# EasyEDA Pro project QRS959041_JiaLichuang.epro

# Schematic Schematic1
Create Date: 2025-01-12; Page Name: P1; Project Name: 1.12寒假; Schematic Name: Schematic1; Update Date: 2025-02-10; Company: 嘉立创EDA; Page Size: A4; Version: V1.0
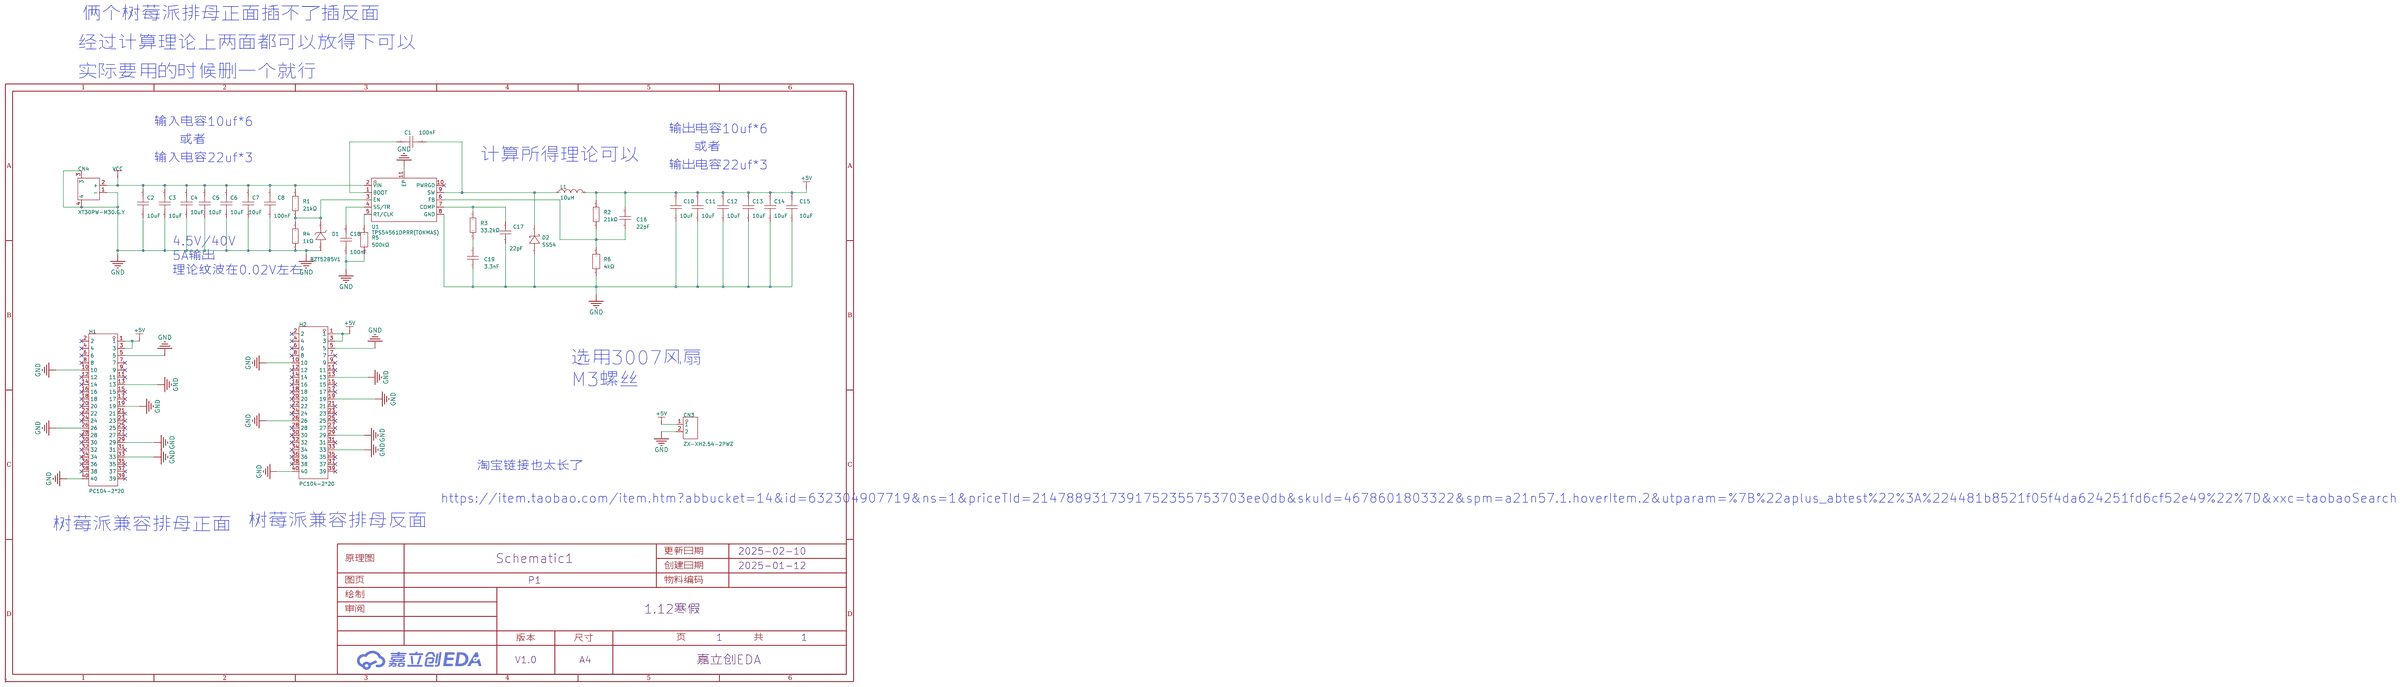
[diagram p0: schematic sheet]

## Parts
C1  100nF  [C0603]
C2  10uF  [C0805]
C3  10uF  [C0805]
C4  10uF  [C0805]
C5  10uF  [C0805]
C6  10uF  [C0805]
C7  10uF  [C0805]
C8  100nF  [C0603]
C10  10uF  [C0805]
C11  10uF  [C0805]
C12  10uF  [C0805]
C13  10uF  [C0805]
C14  10uF  [C0805]
C15  10uF  [C0805]
C16  22pF  [C0603]
C17  22pF  [C0603]
C18  100nF  [C0603]
C19  3.3nF  [C0603]
CN3  ZX-XH2.54-2PWZ  [CONN-TH_2P-P2.50_ZX-XH2.54-2PWZ]
CN4  XT30PW-M30.G.Y  [CONN-TH_XT30PW-M]
D1  BZT52B5V1  [SOD-123_L2.7-W1.6-LS3.7-RD]
D2  SS54  [SMA_L4.3-W2.6-LS5.0-FD]
H1  PC104-2*20  [HDR-TH_40P-P2.54-V-F-R2-C20-S2.54-2]
H2  PC104-2*20  [HDR-TH_40P-P2.54-V-F-R2-C20-S2.54-2]
L1  10uH  [IND-SMD_L7.3-W6.8]
R1  21kΩ  [R0603]
R2  21kΩ  [R0603]
R3  33.2kΩ  [R0603]
R4  1kΩ  [R0603]
R5  500kΩ  [R0603]
R6  4kΩ  [R0603]
U1  TPS54561DPRR(TOKMAS)  [WDFN-10_L4.0-W4.0-P0.80-BL-EP]

## Library data of the parts
C1 C8 C18 = CGA0603X7R104K500JT: 容值:100nF;精度:±10%;额定电压:50V;材质(温度系数):X7R;; LCSC Part Name: 100nF ±10% 50V; Supplier Part: C6119867; Manufacturer: HRE(芯声); Supplier Footprint: 0603; JLCPCB Part Class: Extended Part; Supplier: LCSC; Tolerance: ±10%; Voltage Rated: 50V; Temperature Coefficient: X7R
C2-C7 C10-C15 = GRM21BR61H106KE43L: 容值:10uF;精度:±10%;额定电压:50V;材质(温度系数):X5R;; LCSC Part Name: 10uF ±10% 50V; Supplier Part: C440198; Manufacturer: muRata(村田); Supplier Footprint: 0805; JLCPCB Part Class: 基础库; Datasheet: https://atta.szlcsc.com/upload/public/pdf/source/20230811/95AAE0C9AF55EDC31B7A4D8B733F534E.pdf; Supplier: LCSC; Tolerance: ±10%; Voltage Rated: 50V; Temperature Coefficient: X5R
C16 C17 = CC0603JRNPO9BN220: 容值:22pF;精度:±5%;额定电压:50V;材质(温度系数):NP0;; LCSC Part Name: 22pF ±5% 50V; Supplier Part: C105620; Manufacturer: YAGEO(国巨); Supplier Footprint: 0603; JLCPCB Part Class: Extended Part; Datasheet: https://atta.szlcsc.com/upload/public/pdf/source/20170505/1493957838062.pdf; Supplier: LCSC; Tolerance: ±5%; Voltage Rated: 50V; Temperature Coefficient: NP0
C19 = CL10B332KB8NNNC: 容值:3.3nF;精度:±10%;额定电压:50V;材质(温度系数):X7R;; LCSC Part Name: 3.3nF ±10% 50V; Supplier Part: C1613; Manufacturer: SAMSUNG(三星); Supplier Footprint: 0603; JLCPCB Part Class: 基础库; Datasheet: https://atta.szlcsc.com/upload/public/pdf/source/20160218/1457707763339.pdf; Supplier: LCSC; Tolerance: ±10%; Voltage Rated: 50V; Temperature Coefficient: X7R
CN3 = ZX-XH2.54-2PWZ: 插针结构:1x2P;间距:-;安装方式:弯插;参考系列:XH;总PIN数:2P;排数:1;每排PIN数:2;行距:-;额定电流:3A;触头材质:黄铜;触头镀层:锡;工作温度范围:-25℃~+85℃;; LCSC Part Name: 1x2P 弯插 系列:XH; Supplier Part: C7429641; Manufacturer: Megastar(兆星); Supplier Footprint: 弯插,P=2.5mm; JLCPCB Part Class: 扩展库; Datasheet: https://atta.szlcsc.com/upload/public/pdf/source/20230619/56AE8F2E01CDFEAA97FC89B5ED558AB5.pdf; Supplier: LCSC; Pins Structure: 1x2P; Mounting Style: 弯插; Reference Series: XH; Number of Pins: 2P; Number of Rows: 1; Number of PINs Per Row: 2; Current Rating (Max): 3A; Contact Material: 黄铜; Contact Plating: 锡; Operating Temperature Range: -25℃~+85℃
CN4 = XT30PW-M30.G.Y: 类别:-;类型1:-;; LCSC Part Name: AMASS(艾迈斯)航模插头 卧式弯脚 XT30PW-M公头; Supplier Part: C431092; Manufacturer: AMASS(艾迈斯); JLCPCB Part Class: 扩展库; Datasheet: https://atta.szlcsc.com/upload/public/pdf/source/20220222/6A9F22F7850E25B33E1BE430ADF8560B.pdf; Supplier: LCSC; Type: 航模插头; RatedVoltage: DC 500V; InterfaceType: 公头; RatedCurrent: 15A; RecommendedWireGauge: 16/18/20AWG; contact resistance: 1.2mΩ; specifications: 2pin
D1 = BZT52B5V1_C19077393: 二极管配置:独立式;稳压值(标称值):5.1V;稳压值(范围):5V~5.2V;功率(Pd):500mW;; Supplier Part: C19077393; Manufacturer: 宏迦橙; Supplier Footprint: SOD-123; JLCPCB Part Class: 扩展库; Datasheet: https://atta.szlcsc.com/upload/public/pdf/source/20231025/7B522980EF7B3ADB7D8180AF5C922201.pdf; Supplier: LCSC; Diode Configuration: 独立式; Zener Voltage (Nom): 5.1V; Reverse Leakage Current (Ir): 2uA@2V; Zener Voltage (Range): 5V~5.2V; Power Dissipation: 500mW; Zener Impedance (Zzt): 60Ω
D2 = SS54_C7420369: 二极管配置:独立式;正向压降(Vf):550mV@5.0A;直流反向耐压(Vr):40V;整流电流:5A;; LCSC Part Name: 电压:40V 电流:5A; Supplier Part: C7420369; Manufacturer: 宏迦橙; Supplier Footprint: SMA(DO-214AC); JLCPCB Part Class: Extended Part; Datasheet: https://atta.szlcsc.com/upload/public/pdf/source/20230828/254C3882F8647358AD9F60DD73611B5E.pdf; Supplier: LCSC; Diode Configuration: 独立式; Forward Voltage (Vf@If): 550mV@5.0A; Reverse Voltage (Vr): 40V; Rectified Current: 5A; Reverse Leakage Current (Ir): 50uA@40V
H1 H2 = PC104-2*20: Supplier Part: C5307344; Manufacturer: ZHOURI(洲日); Supplier Footprint: 插件,P=2.54mm; JLCPCB Part Class: 扩展库; Datasheet: https://atta.szlcsc.com/upload/public/pdf/source/20231215/5B69979F62C9B9EBFCC01315FC39F2FE.pdf; Supplier: LCSC
L1 = FXL0630-100-M: 电感值:10uH;精度:±20%;额定电流:4.5A;饱和电流(Isat):5.5A;类型:一体成型电感;; LCSC Part Name: 10uH ±20% 5.5A; Supplier Part: C167223; Manufacturer: cjiang(长江微电); Supplier Footprint: SMD,6.6x7mm; JLCPCB Part Class: 扩展库; Datasheet: https://atta.szlcsc.com/upload/public/pdf/source/20240426/3189EA8206330E2108542F9E34E540E7.pdf; Supplier: LCSC; Tolerance: ±20%; Rated Current: 4.5A; Saturation Current (Isat): 5.5A; DC Resistance (DCR): 68mΩ; Type: 一体成型电感
R1 R2 = 0603WAF2102T5E: 电阻类型:厚膜电阻;阻值:21kΩ;精度:±1%;功率:100mW;最大工作电压:75V;温度系数:±100ppm/℃;; LCSC Part Name: 21kΩ ±1% 100mW 厚膜电阻; Supplier Part: C22956; Manufacturer: UNI-ROYAL(厚声); Supplier Footprint: 0603; JLCPCB Part Class: 扩展库; Datasheet: https://atta.szlcsc.com/upload/public/pdf/source/20200306/C422600_1E6D84923E4A46A82E41ADD87F860B5C.pdf; Supplier: LCSC; Type: 厚膜电阻; Tolerance: ±1%; Power(Watts): 100mW; Overload Voltage (Max): 75V; Temperature Coefficient: ±100ppm/℃; Operating Temperature Range: -55℃~+155℃
R3 = RC0603FR-0733K2L: 电阻类型:厚膜电阻;阻值:33.2kΩ;精度:±1%;功率:100mW;最大工作电压:75V;温度系数:±100ppm/℃;; LCSC Part Name: 厚膜电阻 33.2kΩ ±1% 100mW; Supplier Part: C185338; Manufacturer: YAGEO(国巨); Supplier Footprint: 0603; JLCPCB Part Class: 扩展库; Datasheet: https://atta.szlcsc.com/upload/public/pdf/source/20180904/C276339_014E484F1DBA106FB92D45EABD5A1AC1.pdf; Supplier: LCSC; Type: 厚膜电阻; Tolerance: ±1%; Power(Watts): 100mW; Overload Voltage (Max): 75V; Temperature Coefficient: ±100ppm/℃; Operating Temperature Range: -55℃~+155℃
R4 = 0603WAF1001T5E: 电阻类型:厚膜电阻;阻值:1kΩ;精度:±1%;功率:100mW;最大工作电压:75V;温度系数:±100ppm/℃;; LCSC Part Name: 1kΩ ±1% 100mW 厚膜电阻; Supplier Part: C21190; Manufacturer: UNI-ROYAL(厚声); Supplier Footprint: 0603; JLCPCB Part Class: Basic Part; Datasheet: https://atta.szlcsc.com/upload/public/pdf/source/20200306/C422600_1E6D84923E4A46A82E41ADD87F860B5C.pdf; Supplier: LCSC; Type: 厚膜电阻; Tolerance: ±1%; Power(Watts): 100mW; Overload Voltage (Max): 75V; Temperature Coefficient: ±100ppm/℃; Operating Temperature Range: -55℃~+155℃
R5 = AR03BTCX5003N: 电阻类型:薄膜电阻;阻值:500kΩ;精度:±0.1%;功率:100mW;最大工作电压:50V;温度系数:±25ppm/℃;; LCSC Part Name: 薄膜电阻 500kΩ ±0.1% 100mW; Supplier Part: C2902631; Manufacturer: Viking(光颉); Supplier Footprint: 0603; JLCPCB Part Class: 扩展库; Datasheet: https://atta.szlcsc.com/upload/public/pdf/source/20191129/C465721_10D49275DB41E427863CE9C8D788770A.pdf; Supplier: LCSC; Type: 薄膜电阻; Tolerance: ±0.1%; Power(Watts): 100mW; Overload Voltage (Max): 50V; Temperature Coefficient: ±25ppm/℃; Operating Temperature Range: -55℃~+155℃
R6 = ARG03FTC4001N: 电阻类型:薄膜电阻;阻值:4kΩ;精度:±1%;; LCSC Part Name: 4kΩ ±1%; Supplier Part: C2984443; Manufacturer: Viking(光颉); Supplier Footprint: 0603; JLCPCB Part Class: Extended Part; Datasheet: https://atta.szlcsc.com/upload/public/pdf/source/20200117/C485675_99063924B4564AF910B7BE66DA8EFA49.pdf; Supplier: LCSC; Type: 薄膜电阻; Tolerance: ±1%
U1 = TPS54561DPRR(TOKMAS): 功能类型:降压型;输出类型:可调;输入电压:4.5V~60V;输出电压:800mV~59V;输出电流(最大值):5A;; Supplier Part: C7589231; Manufacturer: Tokmas(托克马斯); Supplier Footprint: DFN-10(4x4); JLCPCB Part Class: 扩展库; Datasheet: https://atta.szlcsc.com/upload/public/pdf/source/20231017/81F8E4560E5C518AD42B3101CD4242C0.pdf; Supplier: LCSC; Function: 降压型; Output Type: 可调; Input Voltage: 4.5V~60V; Output Voltage: 800mV~59V; Output Current (Max): 5A; Switch tube (built-in/external): 内置

## Nets
+5V: C10.2 C11.2 C12.2 C13.2 C14.2 C15.2 C16.1 CN3.1 H1.1 H1.3 H2.1 H2.3 L1.2 R2.2
GND: C2.1 C3.1 C4.1 C5.1 C6.1 C7.1 C8.1 C10.1 C11.1 C12.1 C13.1 C14.1 C15.1 C17.2 C18.1 C19.1 CN3.2 CN4.1(-) CN4.3 CN4.4 D1.2(A) D2.1(A) H1.5 H1.10 H1.13 H1.19 H1.26 H1.29 H1.33 H1.40 H2.5 H2.10 H2.13 H2.19 H2.26 H2.29 H2.33 H2.40 R4.1 R5.1 R6.1 U1.8(GND) U1.11(EP)
VCC: C2.2 C3.2 C4.2 C5.2 C6.2 C7.2 C8.2 CN4.2(+) R1.2 U1.2(VIN)
$1N1695: C1.1 U1.1(BOOT)
$1N1947: C18.2 U1.4(SS/TR)
$1N2224: D1.1(K) R1.1 R4.2 U1.3(EN)
$1N2488: R5.2 U1.5(RT/CLK)
$1N2758: C1.2 D2.2(K) L1.1 U1.9(SW)
$1N3123: C17.1 R3.2 U1.7(COMP)
$1N3200: C16.2 R2.1 R6.2 U1.6(FB)
$1N8074: C19.2 R3.1

Not connected (* = marked no-connect by the designer): H1 2* 4* 6* 7* 8* 9* 11* 12* 14* 15* 16* 17* 18* 20* 21* 22* 23* 24* 25* 27* 28* 30* 31* 32* 34* 35* 36* 37* 38* 39*; H2 2* 4* 6* 7* 8* 9* 11* 12* 14* 15* 16* 17* 18* 20* 21* 22* 23* 24* 25* 27* 28* 30* 31* 32* 34* 35* 36* 37* 38* 39*; U1 10(PWRGD)*

## Notes on the sheet
- 俩个树莓派排母正面插不了插反面
- 经过计算理论上两面都可以放得下可以
- 实际要用的时候删一个就行
- 输入电容10uf*6
- 输出电容10uf*6
- 或者
- 或者
- 输入电容22uf*3
- 计算所得理论可以
- 输出电容22uf*3
- 4.5V/40V
  5A输出
  理论纹波在0.02V左右
- 选用3007风扇
  M3螺丝
- 淘宝链接也太长了
- https://item.taobao.com/item.htm?abbucket=14&id=632304907719&ns=1&priceTId=2147889317391752355753703ee0db&skuId=4678601803322&spm=a21n57.1.hoverItem.2&utparam=%7B%22aplus_abtest%22%3A%224481b8521f05f4da624251fd6cf52e49%22%7D&xxc=taobaoSearch
- 树莓派兼容排母反面
- 树莓派兼容排母正面

# Board PCB1
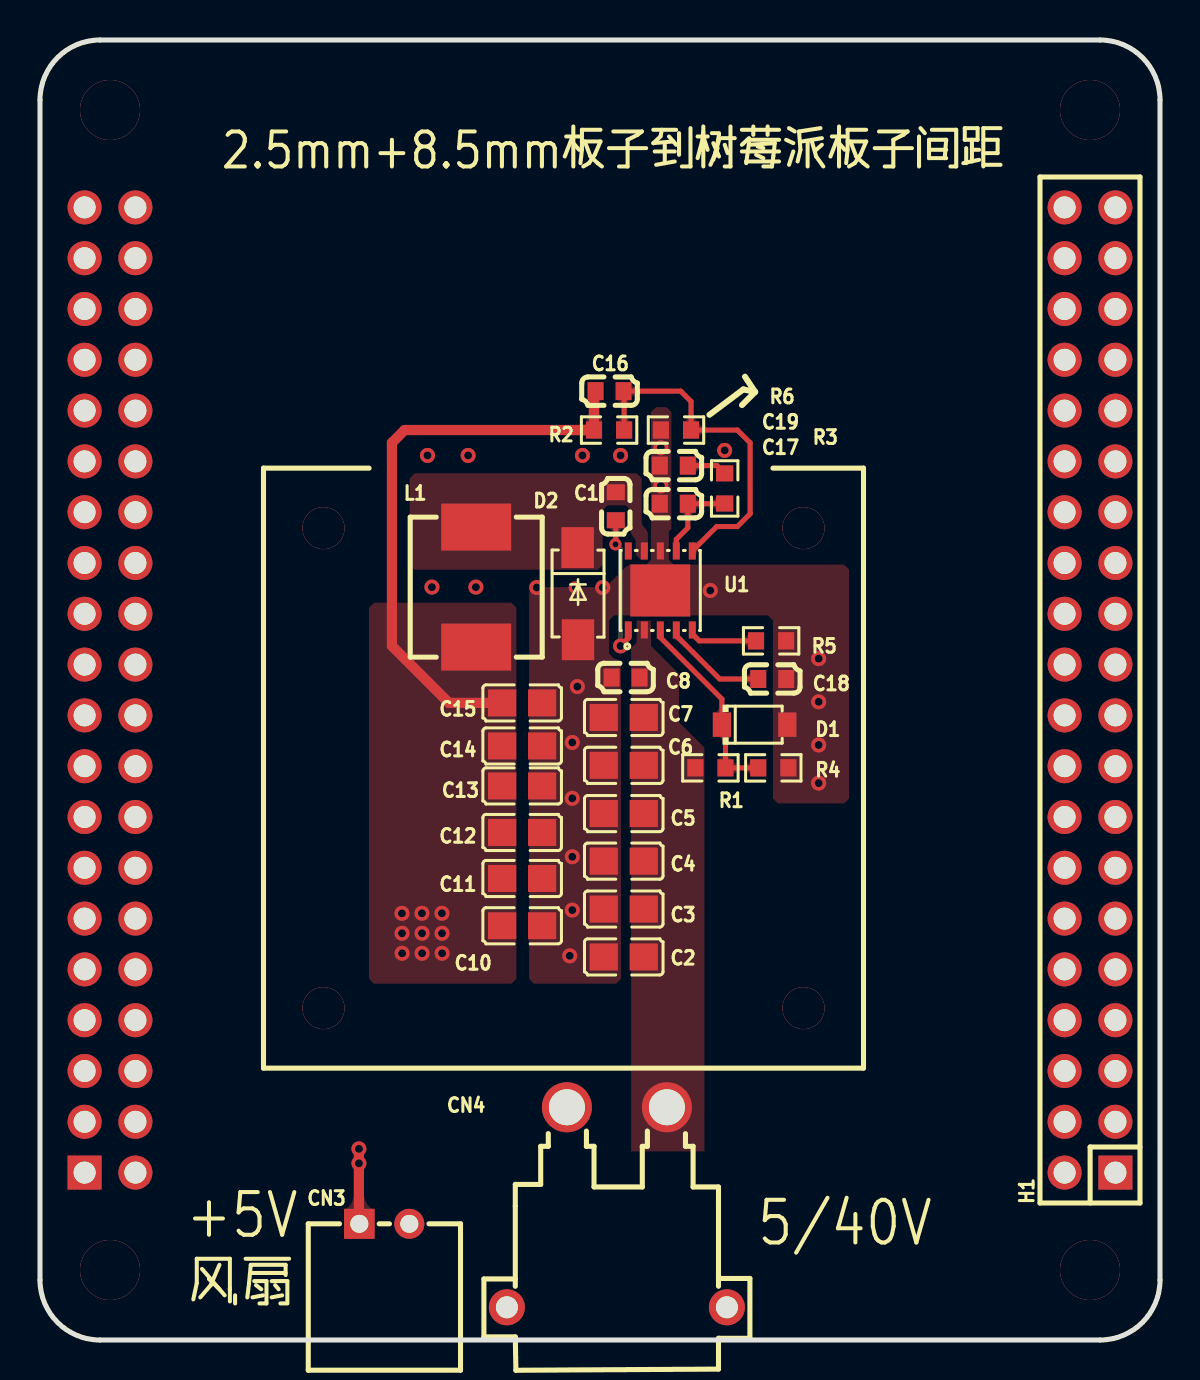
[diagram p1: board, top side]
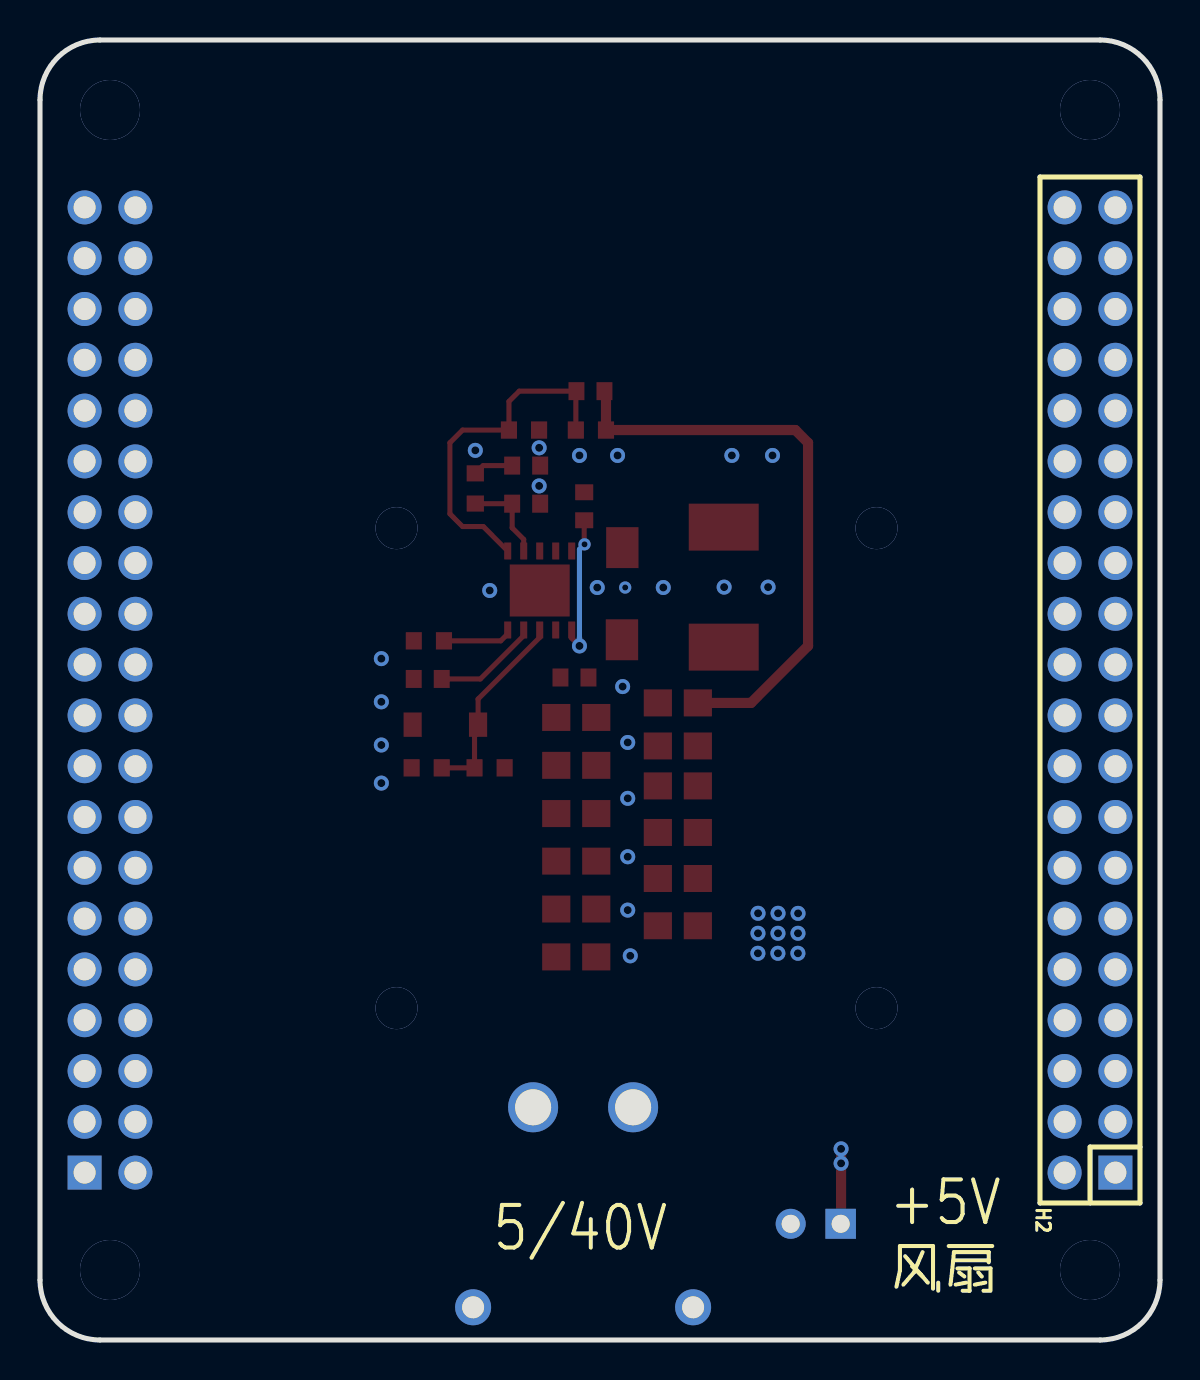
[diagram p2: board, bottom side, seen from below]

Outline 56 x 65 mm; copper layers: Top Layer, 地, 电源, Bottom Layer. Coordinates in mm from the lower left corner of the outline.
Outline path: 0,62 arc(0.88,64.12) 3,65 53,65 arc(55.12,64.12) 56,62 56,3 arc(55.12,0.88) 53,0 3,0 arc(0.88,0.88) 0,3 0,62
Stack: Top Layer 0.035mm 外层铜厚1oz / Dielectric1 0.2104mm 7628 RC49% 8.6mil / 地 0.0152mm 内层铜厚 / Dielectric2 1.065mm 1.1mm H/HOZ 含铜 / 电源 0.0152mm 内层铜厚 / Dielectric3 0.2104mm 7628 RC49% 8.6mil / Bottom Layer 0.035mm 外层铜厚1oz

## Design rules (mm)
template: 自定义配置
spacing copperThickness1oz (default): track to track 0.102, other pairs 0.152 to 0.3
spacing copperThickness2oz: track to track 0.203, other pairs 0.152 to 0.3
track width copperThickness1oz (default): min 0.127, default 0.254, max 2.54
track width copperThickness2oz: min 0.203, default 0.254, max 2.54
differential pair differentialPair (default): width min 0.127, default 0.254, max 2.54; gap min 0.152, default 0.152
via viaSize (default): diameter min 0.5, default 0.61, max 10; hole min 0.3, default 0.305, max 6.299

## Placement (name value [footprint] x y rotation side)
C1  100nF  [C0603]  28.79 41.69 90 top
C2  10uF  [C0805]  29.19 19.15 0 top
C3  10uF  [C0805]  29.19 21.55 0 top
C4  10uF  [C0805]  29.19 23.94 0 top
C5  10uF  [C0805]  29.19 26.32 0 top
C6  10uF  [C0805]  29.19 28.73 0 top
C7  10uF  [C0805]  29.19 31.13 0 top
C8  100nF  [C0603]  29.28 33.12 0 top
C10  10uF  [C0805]  24.11 20.71 180 top
C11  10uF  [C0805]  24.11 23.08 180 top
C12  10uF  [C0805]  24.11 25.38 180 top
C13  10uF  [C0805]  24.11 27.7 180 top
C14  10uF  [C0805]  24.11 29.7 180 top
C15  10uF  [C0805]  24.11 31.85 180 top
C16  22pF  [C0603]  28.48 47.44 0 top
C17  22pF  [C0603]  31.69 41.82 180 top
C18  100nF  [C0603]  36.61 33.05 180 top
C19  3.3nF  [C0603]  31.69 43.72 0 top
CN3  ZX-XH2.54-2PWZ  [CONN-TH_2P-P2.50_ZX-XH2.54-2PWZ]  17.22 5.81 0 top
CN4  XT30PW-M30.G.Y  [CONN-TH_XT30PW-M]  28.84 6.64 0 top
D1  BZT52B5V1  [SOD-123_L2.7-W1.6-LS3.7-RD]  35.73 30.77 0 top
D2  SS54  [SMA_L4.3-W2.6-LS5.0-FD]  26.89 37.31 90 top
H1  PC104-2*20  [HDR-TH_40P-P2.54-V-F-R2-C20-S2.54-2]  52.5 32.5 90 top
H2  PC104-2*20  [HDR-TH_40P-P2.54-V-F-R2-C20-S2.54-2]  3.5 32.5 90 bottom
L1  10uH  [IND-SMD_L7.3-W6.8]  21.81 37.64 270 top
R1  21kΩ  [R0603]  33.52 28.61 180 top
R2  21kΩ  [R0603]  28.45 45.5 180 top
R3  33.2kΩ  [R0603]  34.23 42.58 270 top
R4  1kΩ  [R0603]  36.67 28.61 180 top
R5  500kΩ  [R0603]  36.56 34.96 180 top
R6  4kΩ  [R0603]  31.8 45.5 0 top
U1  TPS54561DPRR(TOKMAS)  [WDFN-10_L4.0-W4.0-P0.80-BL-EP]  31.01 37.48 0 top

## Footprints (pads in the part's own frame, mm; a bottom-side part is the same pattern mirrored in y, then rotated)
C0603
  rect 0.8x0.9 smd: 1(-0.7,0) 2(0.7,0)
C0805
  rect 1.41x1.35 smd: 1(-1,0) 2(1,0)
CONN-TH_2P-P2.50_ZX-XH2.54-2PWZ
  rect 1.524x1.5 hole 0.9: 1(-1.25,0)
  round 1.5 hole 0.9: 2(1.25,0)
CONN-TH_XT30PW-M
  round 2.5 hole 1.8: 1(-2.5,5) 2(2.5,5)
  round 1.8 hole 1.1: 3(5.5,-5) 4(-5.5,-5)
HDR-TH_40P-P2.54-V-F-R2-C20-S2.54-2
  rect 1.7x1.7 hole 1.1: 1(-24.13,-1.27)
  round 1.7 hole 1.1: 2(-24.13,1.27) 3(-21.59,-1.27) 4(-21.59,1.27) 5(-19.05,-1.27) 6(-19.05,1.27) 7(-16.51,-1.27) 8(-16.51,1.27) 9(-13.97,-1.27) 10(-13.97,1.27) 11(-11.43,-1.27) 12(-11.43,1.27) 13(-8.89,-1.27) 14(-8.89,1.27) 15(-6.35,-1.27) 16(-6.35,1.27) 17(-3.81,-1.27) 18(-3.81,1.27) 19(-1.27,-1.27) 20(-1.27,1.27) 21(1.27,-1.27) 22(1.27,1.27) 23(3.81,-1.27) 24(3.81,1.27) 25(6.35,-1.27) 26(6.35,1.27) 27(8.89,-1.27) 28(8.89,1.27) 29(11.43,-1.27) 30(11.43,1.27) 31(13.97,-1.27) 32(13.97,1.27) 33(16.51,-1.27) 34(16.51,1.27) 35(19.05,-1.27) 36(19.05,1.27) 37(21.59,-1.27) 38(21.59,1.27) 39(24.13,-1.27) 40(24.13,1.27)
IND-SMD_L7.3-W6.8
  rect 2.35x3.5 smd: 1(-3,0) 2(3,0)
R0603
  rect 0.806x0.864 smd: 1(-0.753,0) 2(0.753,0)
SMA_L4.3-W2.6-LS5.0-FD
  rect 2.046x1.62 smd: 1(-2.304,-0.009) 2(2.304,0.009)
SOD-123_L2.7-W1.6-LS3.7-RD
  rect 0.91x1.22 smd: 1(-1.635,0) 2(1.635,0)
WDFN-10_L4.0-W4.0-P0.80-BL-EP
  rect 0.35x0.85 smd: 1(-1.6,-1.975) 2(-0.8,-1.975) 3(0,-1.975) 4(0.8,-1.975) 5(1.6,-1.975) 6(1.6,1.975) 7(0.8,1.975) 8(0,1.975) 9(-0.8,1.975) 10(-1.6,1.975)
  rect 3x2.6 smd: 11(0,0)

## Nets
As in the schematic.

Pads without a net: H1 2 4 6 7 8 9 11 12 14 15 16 17 18 20 21 22 23 24 25 27 28 30 31 32 34 35 36 37 38 39; H2 2 4 6 7 8 9 11 12 14 15 16 17 18 20 21 22 23 24 25 27 28 30 31 32 34 35 36 37 38 39; U1 10

## Via types
v1: diameter 3, hole 3, Top Layer to Bottom Layer, 4 vias
v2: diameter 2.1, hole 3.2, Top Layer to Bottom Layer, 4 vias
v3: diameter 0.75, hole 0.4, Top Layer to Bottom Layer, 34 vias
v4: diameter 0.61, hole 0.305, Top Layer to Bottom Layer, 2 vias

## Routing (per net, layer and track width the routed paths; a pad name or vN(x,y) marks a point on that pad's centre or on a via; arc(x,y) is an arc through that point)
+5V: length 33
  Top Layer w0.508: C16.1 27.7,47.37 27.7,45.5 18.23,45.5 17.6,44.86 17.6,34.7 20.45,31.85 C15.2 ; v3(15.95,9.56) v3(15.95,8.83) 15.95,5.83 CN3.1
  vias: v3(18.1,21.33) v3(18.1,20.34) v3(18.1,19.34) v3(19.1,21.34) v3(19.1,20.34) v3(19.1,19.34) v3(20.1,21.34) v3(20.1,20.34) v3(20.1,19.34)
GND:
  vias: v3(19.38,44.23) v3(19.6,37.64) v3(21.41,44.23) v3(21.79,37.64) v3(24.84,37.62) v3(26.49,19.21) v3(26.61,29.88) v3(26.61,27.08) v3(26.61,24.16) v3(26.61,21.5) v3(26.87,32.67) v3(27.12,44.23) v3(28.14,37.62) v3(29.03,44.23) v3(31.04,44.61) v3(31.04,42.7) v3(33.51,37.48) v3(34.23,44.48) v3(38.93,34.07) v3(38.93,31.91) v3(38.93,29.75) v3(38.93,27.85) v4(26.74,37.62)
(no net):
  vias: v1(3.5,61.5) v1(3.5,3.5) v1(52.5,61.5) v1(52.5,3.5) v2(14.18,40.59) v2(14.18,16.59) v2(38.18,40.59) v2(38.18,16.59)
$1N1695: length 7.4
  Top Layer w0.254: C1.1 28.79,39.8 v4(28.77,39.78) ; U1.1 29.41,35.09 v3(29.03,34.7)
  Bottom Layer w0.254: v3(29.03,34.7) 29.03,39.53 v4(28.77,39.78)
$1N1947: length 5.3
  Top Layer w0.254: C18.2 33.98,33.05 31.81,35.22 U1.4
$1N2224: length 9.9
  Top Layer w0.254: U1.3 31.01,35.13 34.1,32.05 34.1,30.77 34.27,30.59 R1.1 R4.2
$1N2488: length 3.5
  Top Layer w0.254: U1.5 32.61,35.31 32.96,34.96 R5.2
$1N3123: length 4.4
  Top Layer w0.254: R3.2 34.23,41.82 C17.1 32.39,40.61 31.81,40.03 U1.7
$1N3200: length 17.4
  Top Layer w0.254: R2.1 29.21,47.41 C16.2 32.04,47.44 32.55,46.93 R6.2 34.87,45.5 35.5,44.86 35.5,41.31 34.87,40.67 33.84,40.67 U1.6
$1N8074: length 2
  Top Layer w0.254: C19.2 33.84,43.72 R3.1

## Copper pours and planes (outline as drawn; the poured copper is in the pictures)
+5V on Top Layer: 16.45,36.86 23.82,36.86 23.82,17.81 16.45,17.81
+5V on 电源: -5.86,-14.99 -5.86,69.33 60.72,69.33 60.72,-14.99
+5V on 电源: 14.74,11.26 17.24,11.26 17.24,6.19 14.74,6.19
+5V on 电源: 52.5,12.31 55,12.31 55,6.99 52.5,6.99
+5V on 电源: 1,12.17 3.5,12.17 3.5,6.85 1,6.85
GND on Top Layer: 24.46,46.64 40.46,46.64 40.46,17.81 24.46,17.81
GND on Top Layer: -23.17,75.6 97.86,75.6 97.86,-32.35 -23.17,-32.35
GND on Bottom Layer: -16.06,70.26 62.56,70.26 62.56,-2.83 -16.06,-2.83
GND on 地: -14.41,79.53 85.16,79.53 85.16,-17.11 -14.41,-17.11
VCC on Top Layer: 29.56,35.97 33.22,35.97 33.22,9.43 29.56,9.43
$1N2758 on Top Layer: 18.49,43.33 30.39,43.33 30.39,38.51 18.49,38.51

Small or netless copper shapes (teardrops, artwork), in the pictures only: 31 on Top Layer, 2 on Bottom Layer

## Text on the board
Bottom Silkscreen Layer: 5/40V | +5V / 风扇
Top Silkscreen Layer: 5/40V | 2.5mm+8.5mm板子到树莓派板子间距 | +5V / 风扇
